# EAGLE design halfbridge (EAGLE 9.4.2)
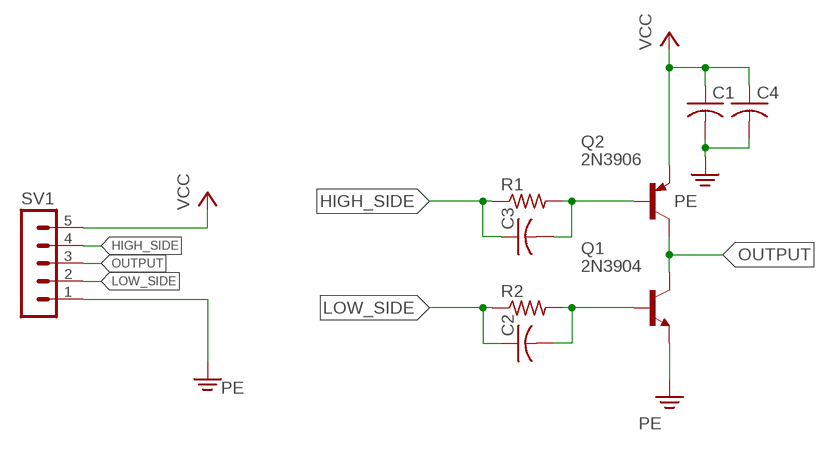
[diagram p0: schematic, sheet 1]

## Parts
C1  C-US050-024X044  [C050-024X044]
C2  C-US050-024X044  [C050-024X044]
C3  C-US050-024X044  [C050-024X044]
C4  C-US050-024X044  [C050-024X044]
Q1  2N3904  [TO-92]
Q2  2N3906  [TO-92]
R1  R-US_0204/5  [0204/5]
R2  R-US_0204/5  [0204/5]
SV1  MA05-1  [MA05-1]

## Nets
HIGH_SIDE: C3.1 R1.1 SV1.4
LOW_SIDE: C2.1 R2.1 SV1.2
N$4: C3.2 Q2.B R1.2
N$5: C2.2 Q1.B R2.2
OUTPUT: Q1.C Q2.C SV1.3
PE: C1.2 C4.2 Q1.E SV1.1
VCC: C1.1 C4.1 Q2.E SV1.5

## Library data of the parts
C1-C4 = rcl:C-US: CAPACITOR, American symbol; SPICEPREFIX: C
Q1 = transistors:2N3904
Q2 = transistors:2N3906
R1 R2 = rcl:R-US_: RESISTOR, American symbol; SPICEPREFIX: R
SV1 = con-lstb:MA05-1: PIN HEADER; OC_FARNELL: unknown; OC_NEWARK: unknown

## Board
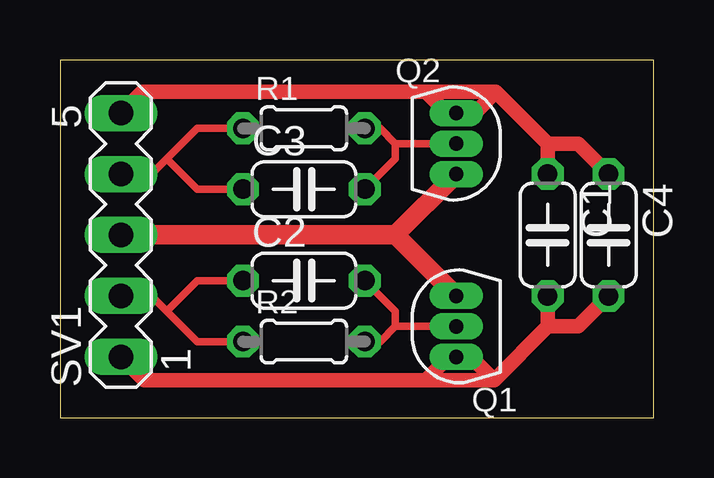
[diagram p1: board, top side]

Size 24.75 x 14.91 mm. Coordinates in mm from the lower left corner, seen from the top.
Outline: 0,0 24.75,0 24.75,14.91 0,14.91 0,0
Copper layers (1*16): Top 0.035mm / dielectric 1.5mm / Bottom 0.035mm
Design rules "default": minimum track width 6mil, minimum drill 0.35mm, track to track 6mil, track to pad 6mil, pad to pad 6mil, via to via 6mil, smd to smd 6mil, copper to edge 40mil, drill to drill 6mil, minimum pad ring 10mil, minimum via ring 8mil, stop-mask expansion 4mil, vias tented up to drill 0mil, thermal gap 10mil

### Footprints (pad centres in the part's own frame; a part is rotated, then mirrored left to right if it is on the bottom)
C050-024X044 = drill 0.813 octagon: 1 -2.54,0; 2 2.54,0
TO-92 = drill 0.6 pad 0.762 long: B 0,0; C 0,-1.27; E 0,1.27
0204/5 = drill 0.813 octagon: 1 -2.54,0; 2 2.54,0
MA05-1 = drill 1.016 long: 1 -5.08,0; 2 -2.54,0; 3 0,0; 4 2.54,0; 5 5.08,0

### Placement (x,y rotation side)
C1  20.32,7.62 270 top
C2  10.16,5.71 0 top
C3  10.16,9.53 0 top
C4  22.86,7.62 270 top
Q1  16.51,3.81 180 top
Q2  16.51,11.43 0 top
R1  10.16,12.06 0 top
R2  10.16,3.17 0 top
SV1  2.54,7.62 90 top

### Tracks (layer width: path | path; a pad name or v marks a point on that pad's centre or on a via)
HIGH_SIDE
  Top 0.305: R1.1 5.71,12.06 4.45,10.79 | SV1.4 3.81,10.16 4.45,10.79 | C3.1 5.71,9.53 4.45,10.79
LOW_SIDE
  Top 0.305: SV1.2 3.81,5.08 4.45,4.45 | 4.45,4.45 5.71,3.17 R2.1 | C2.1 5.71,5.71 4.45,4.45
N$4
  Top 0.305: 13.97,11.43 Q2.B | C3.2 13.97,10.79 13.97,11.43 | R1.2 13.34,12.06 13.97,11.43
N$5
  Top 0.305: 13.97,3.81 Q1.B | C2.2 13.97,4.45 13.97,3.81 | R2.2 13.34,3.17 13.97,3.81
OUTPUT
  Top 0.813: SV1.3 13.97,7.62 | Q2.C 13.97,7.62 | Q1.C 13.97,7.62
PE
  Top 0.61: C1.2 20.32,3.81 | SV1.1 3.5,1.57 15.24,1.57 | Q1.E 16.61,2.54 | 20.32,3.81 18.09,1.57 | 18.09,1.57 15.24,1.57 | Q1.E 17.12,2.54 18.09,1.57 | Q1.E 16.2,2.54 15.24,1.57 | C4.2 21.59,3.81 20.32,3.81
VCC
  Top 0.61: 18.16,13.59 20.32,11.43 | 20.32,11.43 C1.1 | SV1.5 3.43,13.59 15.24,13.59 | 15.24,13.59 18.16,13.59 | 15.24,13.59 16.13,12.7 Q2.E 17.27,12.7 18.16,13.59 | C4.1 21.59,11.43 20.32,11.43